# Altium schematic sheet TDC.SchDoc: FMC 5GS/s ADC/TDC
size 420 x 297 mm; Author: Agnieszka Bartkowicz; CompanyName: WUT ISE; DrawnBy: Agnieszka Bartkowicz; Engineer: Agnieszka Bartkowicz; Organization: WUT ISE; Address1: PW ISE; Address2: Nowowiejska 15/19 00-665 Warsaw; Address3: gyorka@o2.pl; SheetNumber: 6; SheetTotal: 13; ModifiedBy: -; CheckedDate: -; Title2: TDC Circuit; DivGrp: WUT ISE; Designer: A. Bartkowicz
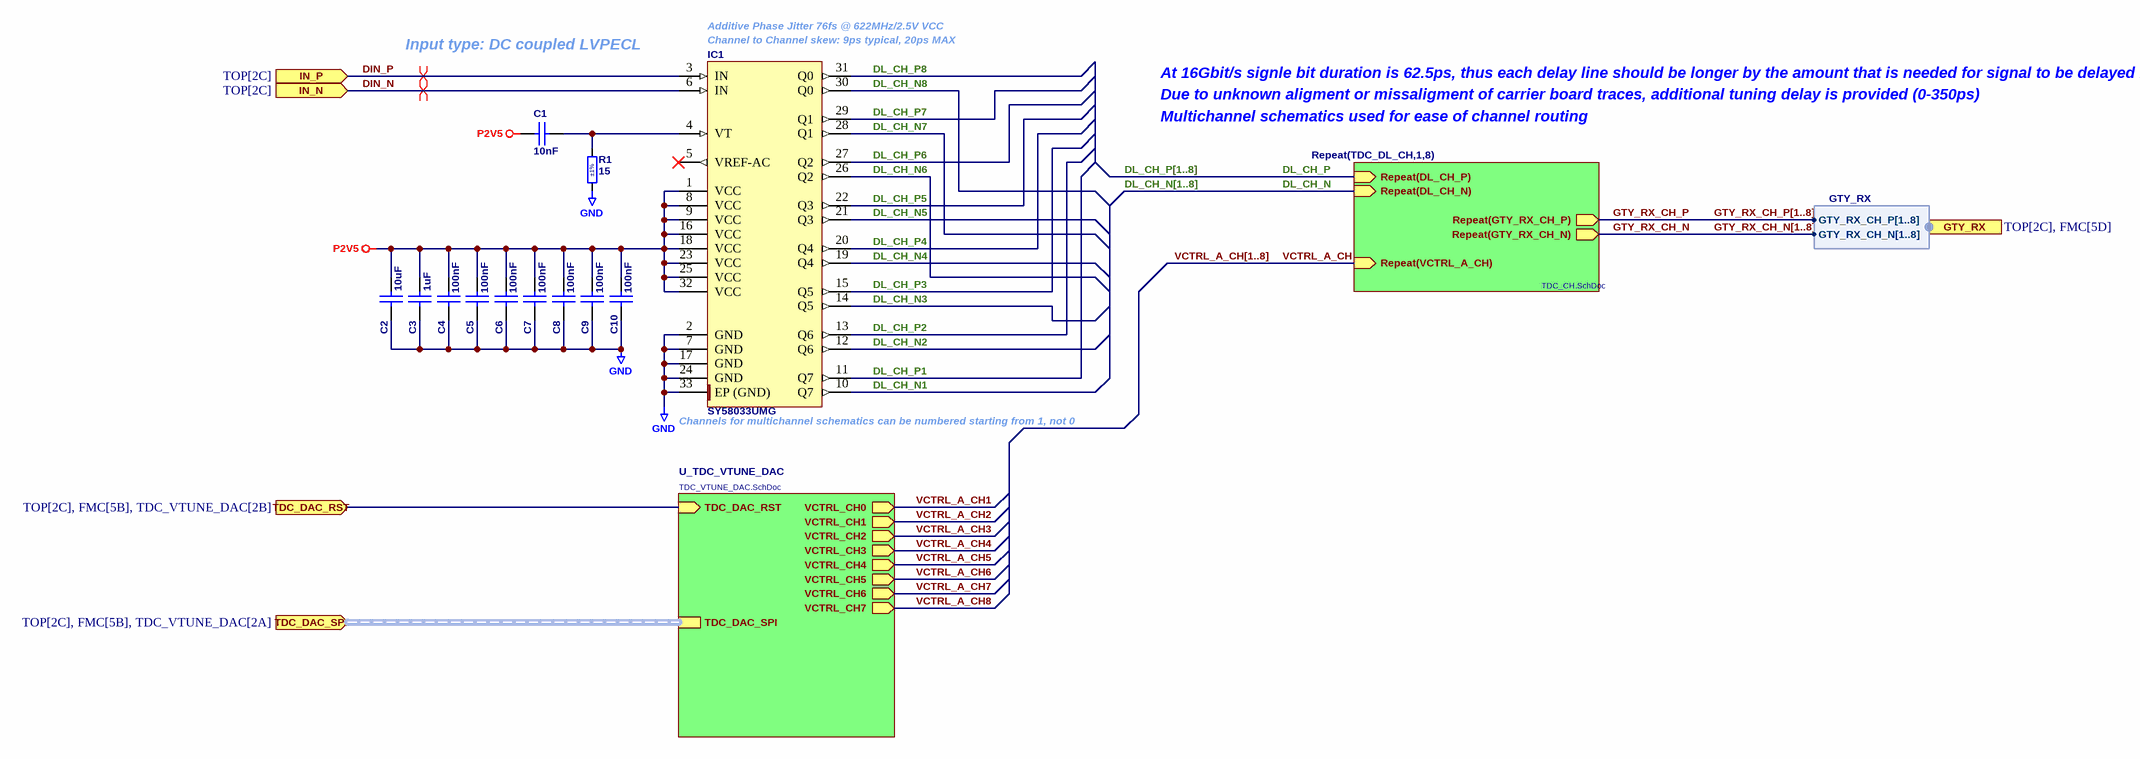
[diagram p0: TDC.SchDoc]

## Parts
C1  10nF  [CAPC1005X55N]
C2  10uF  [CAPC1608X90N]
C3  1uF  [CAPC1005X55N]
C4  100nF  [CAPC1005X55N]
C5  100nF  [CAPC1005X55N]
C6  100nF  [CAPC1005X55N]
C7  100nF  [CAPC1005X55N]
C8  100nF  [CAPC1005X55N]
C9  100nF  [CAPC1005X55N]
C10  100nF  [CAPC1005X55N]
IC1  SY58033UMG  [QFN50P500X500X90_HS-33N]
R1  15  Tolerance: ±1%  [RESC1005X40N]

## Sub-sheets
Repeat(TDC_DL_CH,1,8) = TDC_CH.SchDoc: Repeat(DL_CH_P) (in), Repeat(DL_CH_N) (in), Repeat(VCTRL_A_CH) (in), Repeat(GTY_RX_CH_P) (out), Repeat(GTY_RX_CH_N) (out)
U_TDC_VTUNE_DAC = TDC_VTUNE_DAC.SchDoc: VCTRL_CH0 (out), VCTRL_CH1 (out), VCTRL_CH2 (out), VCTRL_CH3 (out), VCTRL_CH4 (out), VCTRL_CH5 (out), VCTRL_CH6 (out), VCTRL_CH7 (out), TDC_DAC_SPI (harness SPI), TDC_DAC_RST (in)

## Ports
GTY_RX (in, harness GTY_RX, see TOP[2C], FMC[5D]), IN_N (in, see TOP[2C]), IN_P (in, see TOP[2C]), TDC_DAC_RST (in, see TOP[2C], FMC[5B], TDC_VTUNE_DAC[2B]), TDC_DAC_SPI (in, harness I2C, see TOP[2C], FMC[5B], TDC_VTUNE_DAC[2A])

## Harnesses
GTY_RX: GTY_RX_CH_P[1..8], GTY_RX_CH_N[1..8]

## Nets
GND: C2.1 C3.1 C4.1 C5.1 C6.1 C7.1 C8.1 C9.1 C10.1 IC1.2(GND) IC1.7(GND) IC1.17(GND) IC1.24(GND) IC1.33(EP_(GND)) R1.1
P2V5: C1.2 C2.2 C3.2 C4.2 C5.2 C6.2 C7.2 C8.2 C9.2 C10.2 IC1.1(VCC) IC1.8(VCC) IC1.9(VCC) IC1.16(VCC) IC1.18(VCC) IC1.23(VCC) IC1.25(VCC) IC1.32(VCC)
TDC_DAC_RST: port TDC_DAC_RST, sheet U_TDC_VTUNE_DAC/TDC_DAC_RST
DIN_N: IC1.6(IN) ; port IN_N
DIN_P: IC1.3(IN) ; port IN_P
DL_CH_N: sheet Repeat(TDC_DL_CH,1,8)/Repeat(DL_CH_N)
DL_CH_N1: IC1.10(Q7)
DL_CH_N2: IC1.12(Q6)
DL_CH_N3: IC1.14(Q5)
DL_CH_N4: IC1.19(Q4)
DL_CH_N5: IC1.21(Q3)
DL_CH_N6: IC1.26(Q2)
DL_CH_N7: IC1.28(Q1)
DL_CH_N8: IC1.30(Q0)
DL_CH_P: sheet Repeat(TDC_DL_CH,1,8)/Repeat(DL_CH_P)
DL_CH_P1: IC1.11(Q7)
DL_CH_P2: IC1.13(Q6)
DL_CH_P3: IC1.15(Q5)
DL_CH_P4: IC1.20(Q4)
DL_CH_P5: IC1.22(Q3)
DL_CH_P6: IC1.27(Q2)
DL_CH_P7: IC1.29(Q1)
DL_CH_P8: IC1.31(Q0)
GTY_RX_CH_N: sheet Repeat(TDC_DL_CH,1,8)/Repeat(GTY_RX_CH_N)
GTY_RX_CH_P: sheet Repeat(TDC_DL_CH,1,8)/Repeat(GTY_RX_CH_P)
VCTRL_A_CH: sheet Repeat(TDC_DL_CH,1,8)/Repeat(VCTRL_A_CH)
VCTRL_A_CH1: sheet U_TDC_VTUNE_DAC/VCTRL_CH0
VCTRL_A_CH2: sheet U_TDC_VTUNE_DAC/VCTRL_CH1
VCTRL_A_CH3: sheet U_TDC_VTUNE_DAC/VCTRL_CH2
VCTRL_A_CH4: sheet U_TDC_VTUNE_DAC/VCTRL_CH3
VCTRL_A_CH5: sheet U_TDC_VTUNE_DAC/VCTRL_CH4
VCTRL_A_CH6: sheet U_TDC_VTUNE_DAC/VCTRL_CH5
VCTRL_A_CH7: sheet U_TDC_VTUNE_DAC/VCTRL_CH6
VCTRL_A_CH8: sheet U_TDC_VTUNE_DAC/VCTRL_CH7
NetC1_1: C1.1 IC1.4(VT) R1.2

Not connected (* = marked no-connect by the designer): IC1 5(VREF-AC)*

## Buses and harness runs
bus DL_CH_N[1..8]
bus DL_CH_P[1..8]
bus GTY_RX_CH_N[1..8]
bus GTY_RX_CH_P[1..8]
bus VCTRL_A_CH[1..8]
harness port TDC_DAC_SPI = sheet U_TDC_VTUNE_DAC/TDC_DAC_SPI

## Layout directives
differential pair: DIN_N, DIN_P

## Notes on the sheet
- Input type: DC coupled LVPECL
- (near IC1) Additive Phase Jitter 76fs @ 622MHz/2.5V VCC
- (near IC1) Channel to Channel skew: 9ps typical, 20ps MAX
- At 16Gbit/s signle bit duration is 62.5ps, thus each delay line should be longer by the amount that is needed for signal to be delayed by aproximatly 7.8125ps
- Due to unknown aligment or missaligment of carrier board traces, additional tuning delay is provided (0-350ps)
- Multichannel schematics used for ease of channel routing
- (near IC1) Channels for multichannel schematics can be numbered starting from 1, not 0
- Project/Equipment
- Document
- Designer
- Drawn by
- Check.by
- Copyright WUT ISE 2024.
  This documentation describes Open Hardware and is licensed under the CERN OHL v.2. You may redistribute and modify this documentation under the terms of the CERN OHL v.2. (http://ohwr.org/CERNOHL). This documentation is distributed WITHOUT ANY EXPRESS OR IMPLIED WARRANTY, INCLUDING OF MERCHANTABILITY, SATISFACTORY QUALITY AND FITNESS FOR A PARTICULAR PURPOSE. Please see the CERN OHL v.2 for applicable conditions.
- Contact
- File
- Last Mod.
- Print Date
- Sheet
- Size
- A3
- of
- Rev

## Library data of the parts
C1 = CC0402_10NF_16V_10%_X7R: Non-polarised capacitor; Part Description: SMD Multilayer Chip Ceramic Capacitor; Manufacturer: GENERIC; Manufacturer1 Part Number: 223878715636; Voltage: 16V; TC: X7R; Tolerance: ±10%; Part Number: CC0402_10NF_16V_10%_X7R; Component Kind: Standard; Component Type: Standard; Pin Count: 2; Value: 10nF; Status: Not Recommended; Manufacturer Part Number: CC0402_10NF_16V_10%_X7R; Case: 0402; Mounted: Yes; Socket: No; SMD: Yes; Sense: No; Manufacturer1 Example: PHYCOMP; Manufacturer1 ComponentHeight: 0.55mm; HelpURL: \\cern.ch\dfs\Applications\Altium\Datasheets\CC0402_X7R_PHYCOMP.pdf; Author: CERN DEM JLC; CreateDate: 03.12.2007; LatestRevisionDate: 03.12.2007
C2 = CC0603_10UF_16V_10%_X5R_MURATA_GRT188R61C106KE13: Non-polarised capacitor; Part Description: AEC-Q200 Compliant Chip Multilayer Ceramic Capacitor; Manufacturer: MURATA; Voltage: 16V; TC: X5R; Tolerance: ±10%; Part Number: CC0603_10UF_16V_10%_X5R_MURATA_GRT188R61C106KE13; Component Kind: Standard; Component Type: Standard; Pin Count: 2; Value: 10uF; Status: None; Manufacturer Part Number: GRT188R61C106KE13; Case: 0603; Mounted: Yes; Socket: No; SMD: Yes; Sense: No; ComponentHeight: 0.9mm; HelpURL: \\cern.ch\dfs\Applications\Altium\Datasheets\CC0603_MURATA_GRT188R61C106KE13.pdf; Author: CERN DEM HF; CreateDate: 16.06.2022; LatestRevisionDate: 17.06.2022
C3 = CC0402_1UF_16V_10%_X5R: Non-polarised capacitor; Part Description: SMD Multilayer Chip Ceramic Capacitor; Manufacturer: GENERIC; Manufacturer1 Part Number: C1005X5R1C105KT; Voltage: 16V; TC: X5R; Tolerance: ±10%; Part Number: CC0402_1UF_16V_10%_X5R; Component Kind: Standard; Component Type: Standard; Pin Count: 2; Value: 1uF; Status: Preferred; Manufacturer Part Number: CC0402_1UF_16V_10%_X5R; Case: 0402; Mounted: Yes; Socket: No; SMD: Yes; Sense: No; Manufacturer1 Example: TDK; Manufacturer1 ComponentHeight: 0.55mm; HelpURL: \\cern.ch\dfs\Applications\Altium\Datasheets\CC0402_X5R_TDK_C.pdf; Author: CERN DEM JLC; CreateDate: 25.10.2012; LatestRevisionDate: 25.10.2012
C4-C10 = CC0402_100NF_16V_10%_X5R: Non-polarised capacitor; Part Description: SMD Multilayer Chip Ceramic Capacitor; Manufacturer: GENERIC; Manufacturer1 Part Number: GRM155R61C104KA88D; Voltage: 16V; TC: X5R; Tolerance: ±10%; Part Number: CC0402_100NF_16V_10%_X5R; Component Kind: Standard; Component Type: Standard; Pin Count: 2; Value: 100nF; Status: None; Manufacturer Part Number: CC0402_100NF_16V_10%_X5R; Case: 0402; Mounted: Yes; Socket: No; SMD: Yes; Sense: No; Manufacturer1 Example: MURATA; Manufacturer1 ComponentHeight: 0.55mm; HelpURL: \\cern.ch\dfs\Applications\Altium\Datasheets\CC0402_X5R_MURATA_GRM.pdf; Author: CERN DEM JLC; CreateDate: 10.12.2013; LatestRevisionDate: 10.12.2013
IC1 = SY58033U: ULTRA-PRECISION 1:8 BUFFER WITH 400mV LVPECL OUTPUTS AND INTERNAL TERMINATION
R1 = R0402_15R_1%_0.0625W_100PPM: Resistor - 1%; Part Description: General Purpose Thick Film Chip Resistor; Manufacturer: GENERIC; Manufacturer1 Part Number: 232270671509L; TC: ±100ppm/°C; PressFit: No; Part Number: R0402_15R_1%_0.0625W_100PPM; Component Kind: Standard; Component Type: Standard; Pin Count: 2; Value: 15; Status: Not Recommended; Power: 0.0625W; Manufacturer Part Number: R0402_15R_1%_0.0625W_100PPM; Case: 0402; Mounted: Yes; Sense: No; Socket: No; SMD: Yes; Manufacturer1 Example: YAGEO PHYCOMP; Manufacturer1 ComponentHeight: 0.4mm; HelpURL: \\cern.ch\dfs\Applications\Altium\Datasheets\R0402_Phycomp_RC0402.pdf; Author: CERN DEM JLC; CreateDate: 03.12.2007; LatestRevisionDate: 17.10.2012